# Altium schematic sheet LED_adapt.SchDoc
size A
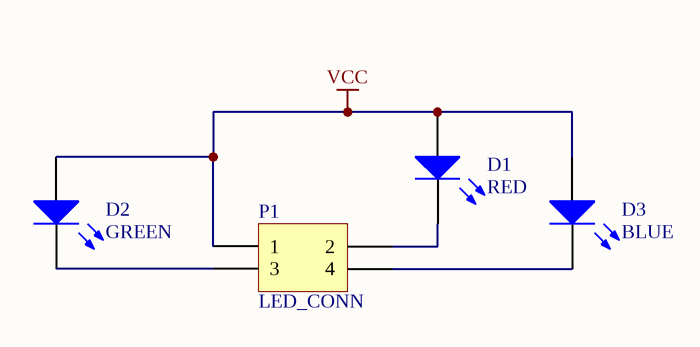
[diagram p0: LED_adapt.SchDoc]

## Parts
D1  RED  [LED-0]
D2  GREEN  [LED-0]
D3  BLUE  [LED-0]
P1  LED_CONN  [HDR2X2]

## Nets
VCC: D1.1(A) D2.1(A) D3.1(A) P1.1
NetD1_2: D1.2(K) P1.2
NetD2_2: D2.2(K) P1.3
NetD3_2: D3.2(K) P1.4

## Library data of the parts
D1-D3 = LED0: Typical INFRARED GaAs LED; Published: 8-Jun-2000; LatestRevisionDate: 08-Jul-2005; LatestRevisionNote: Mech Layer 1 removed.; PackageReference: LED-0; Publisher: Altium Limited
P1 = Header 2X2: Header, 2-Pin, Dual row; LatestRevisionDate: 17-Jul-2002; LatestRevisionNote: Re-released for DXP Platform.; Publisher: Altium Limited